# Altium schematic sheet W5500+HR911105A.SchDoc
size A4
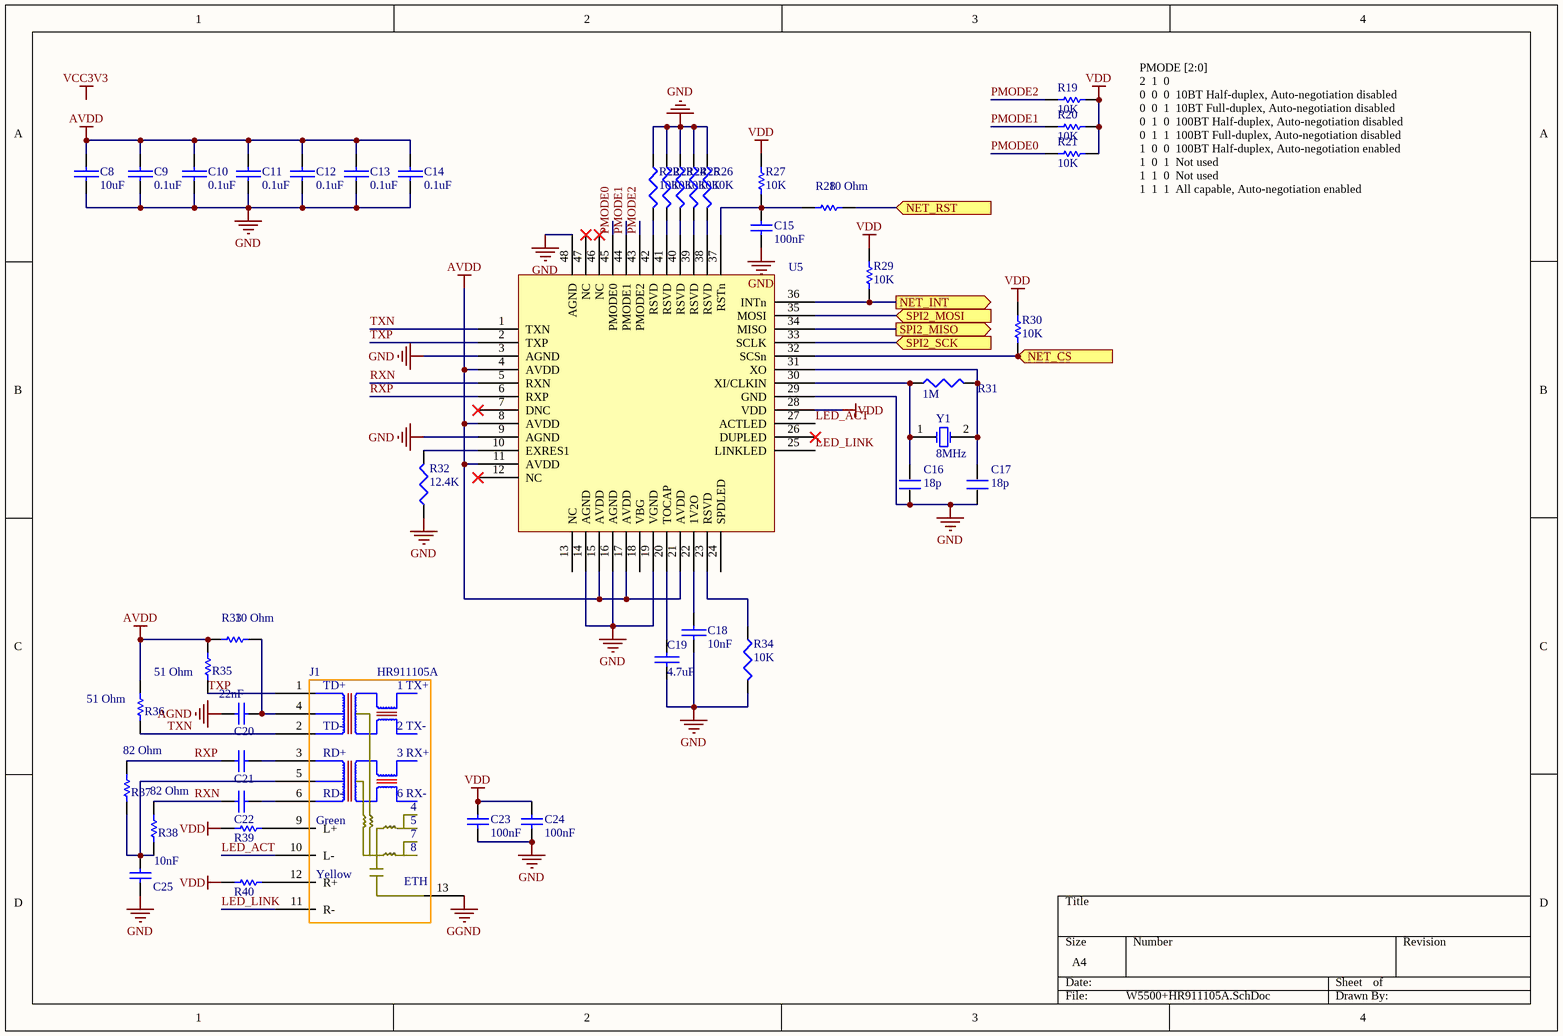
[diagram p0: W5500+HR911105A.SchDoc]

## Parts
C8  10uF  [0805]
C9  0.1uF  [0603]
C10  0.1uF  [0603]
C11  0.1uF  [0603]
C12  0.1uF  [0603]
C13  0.1uF  [0603]
C14  0.1uF  [0603]
C15  value 100nF  [CAPC0805(2012)145_N]  (hidden comment: CAP 100nF 50V 0805(2012))
C16  18p  [0603]
C17  18p  [0603]
C18  10nF  [0603]
C19  4.7uF  [0603]
C20  value 22nF  [CAPC0805(2012)130_N]  (hidden comment: CAP 22nF 50V 0805(2012))
C21  CAP 6.8nF 50V 0805(2012)  [CAPC0805(2012)100_L]  (value not drawn)
C22  CAP 6.8nF 50V 0805(2012)  [CAPC0805(2012)100_L]  (value not drawn)
C23  value 100nF  [CAPC0805(2012)100_L]  (hidden comment: CAP 100nF 50V 0805(2012))
C24  value 100nF  [CAPC0805(2012)100_L]  (hidden comment: CAP 100nF 50V 0805(2012))
C25  value 10nF  [CAPC0805(2012)100_M]  (hidden comment: CAP 10nF 50V 0805(2012))
J1  HR911105A  [HR911102]
R19  value 10K  [RESC0805(2012)_M]  (hidden comment: 10K 1% 0805(2012))
R20  value 10K  [RESC0805(2012)_M]  (hidden comment: 10K 1% 0805(2012))
R21  value 10K  [RESC0805(2012)_M]  (hidden comment: 10K 1% 0805(2012))
R22  10K  [0603]
R23  10K  [0603]
R24  10K  [0603]
R25  10K  [0603]
R26  10K  [0603]
R27  value 10K  [RESC0805(2012)_M]  (hidden comment: 10K 1% 0805(2012))
R28  value 10 Ohm  [RESC0805(2012)_L]  (hidden comment: 10R 5% 0805(2012))
R29  value 10K  [RESC0805(2012)_M]  (hidden comment: 10K 1% 0805(2012))
R30  value 10K  [RESC0805(2012)_M]  (hidden comment: 10K 1% 0805(2012))
R31  1M  [0603]
R32  12.4K  [0603]
R33  value 10 Ohm  [RESC0805(2012)_L]  (hidden comment: 10R 5% 0805(2012))
R34  10K  [0603]
R35  value 51 Ohm  [RESC0805(2012)_N]  (hidden comment: 51R 5% 0805(2012))
R36  value 51 Ohm  [RESC0805(2012)_N]  (hidden comment: 51R 5% 0805(2012))
R37  value 82 Ohm  [RESC0805(2012)_L]  (hidden comment: 82R 5% 0805(2012))
R38  value 82 Ohm  [RESC0805(2012)_L]  (hidden comment: 82R 5% 0805(2012))
R39  270R 5% 0805(2012)  [RESC0805(2012)_N]  (value not drawn)
R40  270R 5% 0805(2012)  [RESC0805(2012)_N]  (value not drawn)
U5  W5500  [LQFP48_N]  (value not drawn)
Y1  8MHz  [XTAL_US]

## Ports
NET_CS (in), NET_INT (out), NET_RST (in), SPI2_MISO (out), SPI2_MOSI (in), SPI2_SCK (in)

## Nets
AGND: C20.1
AVDD: C8.2 C9.1 C10.1 C11.1 C12.1 C13.1 C14.1 R33.2 R35.2 R36.2 U5.4(AVDD) U5.8(AVDD) U5.11(AVDD) U5.15(AVDD) U5.17(AVDD) U5.21(AVDD)
GGND: J1.13
GND: C8.1 C9.2 C10.2 C11.2 C12.2 C13.2 C14.2 C15.1 C16.1 C17.1 C18.2 C19.1 C23.1 C24.1 C25.1 R22.1 R23.1 R24.1 R25.1 R26.1 R32.1 R34.2 U5.3(AGND) U5.9(AGND) U5.14(AGND) U5.16(AGND) U5.19(VGND) U5.29(GND) U5.48(AGND)
VDD: C23.2 C24.2 R19.1 R20.1 R21.1 R27.1 R29.1 R30.1 R39.1 R40.1 U5.28(VDD)
LED_ACT: J1.10(L-) U5.27(ACTLED)
LED_LINK: J1.11(R-) U5.25(LINKLED)
NET_CS: R30.2 U5.32(SCSn) ; port NET_CS
NET_INT: R29.2 U5.36(INTn) ; port NET_INT
NET_RST: R28.1 ; port NET_RST
PMODE0: R21.2 U5.45(PMODE0)
PMODE1: R20.2 U5.44(PMODE1)
PMODE2: R19.2 U5.43(PMODE2)
RXN: C22.1 R38.2 U5.5(RXN)
RXP: C21.1 R37.2 U5.6(RXP)
SPI2_MISO: U5.34(MISO) ; port SPI2_MISO
SPI2_MOSI: U5.35(MOSI) ; port SPI2_MOSI
SPI2_SCK: U5.33(SCLK) ; port SPI2_SCK
TXN: J1.2 R36.1 U5.1(TXN)
TXP: J1.1 R35.1 U5.2(TXP)
NetC15_2: C15.2 R27.2 R28.2 U5.37(RSTn)
NetC16_2: C16.2 R31.1 U5.30(XI/CLKIN) Y1.1(OSC1)
NetC17_2: C17.2 R31.2 U5.31(XO) Y1.2(OSC2)
NetC18_1: C18.1 U5.22(1V2O)
NetC19_2: C19.2 U5.20(TOCAP)
NetC20_2: C20.2 J1.4 R33.1
NetC21_2: C21.2 J1.3
NetC22_2: C22.2 J1.6
NetC25_2: C25.2 J1.5 R37.1 R38.1
NetJ1_9: J1.9(L+) R39.2
NetJ1_12: J1.12(R+) R40.2
NetR22_2: R22.2 U5.42(RSVD)
NetR23_2: R23.2 U5.41(RSVD)
NetR24_2: R24.2 U5.40(RSVD)
NetR25_2: R25.2 U5.39(RSVD)
NetR26_2: R26.2 U5.38(RSVD)
NetR32_2: R32.2 U5.10(EXRES1)
NetR34_1: R34.1 U5.23(RSVD)

Not connected (* = marked no-connect by the designer): U5 7(DNC)* 12(NC)* 13(NC) 18(VBG) 24(SPDLED) 26(DUPLED)* 46(NC)* 47(NC)*

## Notes on the sheet
- PMODE [2:0]
  2  1  0
  0  0  0  10BT Half-duplex, Auto-negotiation disabled
  0  0  1  10BT Full-duplex, Auto-negotiation disabled
  0  1  0  100BT Half-duplex, Auto-negotiation disabled
  0  1  1  100BT Full-duplex, Auto-negotiation disabled
  1  0  0  100BT Half-duplex, Auto-negotiation enabled
  1  0  1  Not used
  1  1  0  Not used
  1  1  1  All capable, Auto-negotiation enabled
- Labels drawn without touching a wire or pin: VCC3V3
- (in symbol HR911102) TD+; 1 TX+; TD-; 2 TX-; RD+; 3 RX+; RD-; 6 RX-; Green; 7; 8; Yellow; ETH

## Library data of the parts
C8 C19 = CAP: 0.1uF
C9-C14 C18 = CAP
C15 = CMP-1036-04417-1: CAP 100nF 50V ±5% 0805 (2012 Metric) Thickness 1.45mm SMD; Case-Metric: 2012; Case-EIA: 0805; Max Thickness: 1.45 mm; Tolerance: ±5%; Rated Voltage: 50 V; Technology: SMT
C16 C17 = C
C20 = CMP-1036-04061-1: CAP 22nF 50V ±5% 0805 (2012 Metric) Thickness 1.2mm SMD; Case-Metric: 2012; Case-EIA: 0805; Max Thickness: 1.2 mm; Rated Voltage: 50 V; Technology: SMT; Tolerance: ±5%
C21 C22 = CMP-1036-03703-1: CAP 6.8nF 50V ±1% 0805 (2012 Metric) Thickness 1mm SMD; Case-Metric: 2012; Case-EIA: 0805; Value: 6.8nF; Tolerance: ±1%; Max Thickness: 1 mm; Technology: SMT; Rated Voltage: 50 V
C23 C24 = CMP-1036-04418-1: CAP 100nF 50V ±5% 0805 (2012 Metric) Thickness 1mm SMD; Case-EIA: 0805; Case-Metric: 2012; Tolerance: ±5%; Max Thickness: 1 mm; Technology: SMT; Rated Voltage: 50 V
C25 = CMP-1036-03837-1: CAP 10nF 50V ±1% 0805 (2012 Metric) Thickness 1mm SMD; Case-Metric: 2012; Case-EIA: 0805; Tolerance: ±1%; Rated Voltage: 50 V; Max Thickness: 1 mm; Technology: SMT
J1 = HR911102
R19-R21 R27 R29 R30 = CMP-1013-00623-1: 10K 0.125W 1% 0805 (2012 Metric)  SMD; Case-Metric: 2012; Case-EIA: 0805; Tolerance: 1 %; Power: 0.125 W; Technology: SMT
R22-R26 R31 R32 R34 = RES1
R28 R33 = CMP-1013-00026-1: 10R 0.125W 5% 0805 (2012 Metric)  SMD; Case-EIA: 0805; Case-Metric: 2012; Technology: SMT; Power: 0.125 W; Tolerance: 5 %
R35 R36 = CMP-1013-00043-1: 51R 0.125W 5% 0805 (2012 Metric)  SMD; Case-Metric: 2012; Case-EIA: 0805; Technology: SMT; Tolerance: 5 %; Power: 0.125 W
R37 R38 = CMP-1013-00048-1: 82R 0.125W 5% 0805 (2012 Metric)  SMD; Case-EIA: 0805; Case-Metric: 2012; Power: 0.125 W; Tolerance: 5 %; Technology: SMT
R39 R40 = CMP-1013-00060-1: 270R 0.125W 5% 0805 (2012 Metric)  SMD; Value: 270.00 Ohm; Case-Metric: 2012; Case-EIA: 0805; Power: 0.125 W; Technology: SMT; Tolerance: 5 %
U5 = W5500: 以太网
Y1 = XTAL: Crystal Oscillator; Published: 8-Jun-2000; LatestRevisionDate: 17-Jul-2002; LatestRevisionNote: Re-released for DXP Platform.; Publisher: Altium Limited